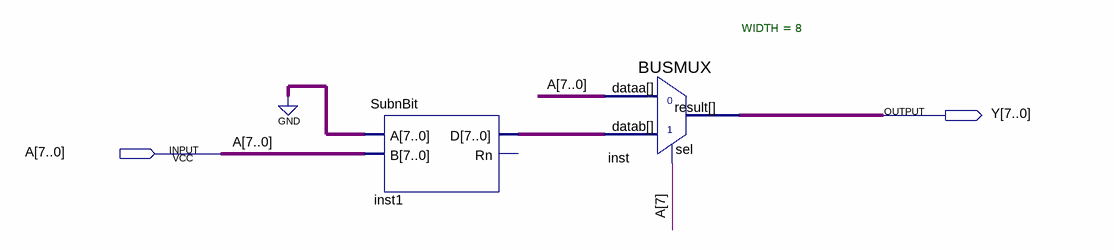
[diagram p0: schematic sheet]
// Quartus schematic TriTuyetDoi.bdf as structural Verilog: 2 symbols, 2 pins
module TriTuyetDoi (
  input  [7:0] A,
  output [7:0] Y
);

  wire [7:0] inst1_d;

  SubnBit inst1 (.A({8{1'b0}}), .B(A), .D(inst1_d));  // open: Rn
  BUSMUX #(.WIDTH(8)) inst (.datab(inst1_d), .sel(A[7]), .dataa(A), .result(Y));
endmodule
